# Altium schematic sheet Cellar Watchdog.SchDoc: Cellar Watchdog - Main
size A4; Date: Dec. 27th 2022; Author: Karl Asseily; DrawnBy: Karl Asseily; DocumentNumber: 202301111111; Revision: 1.2; SheetNumber: 1; SheetTotal: 20
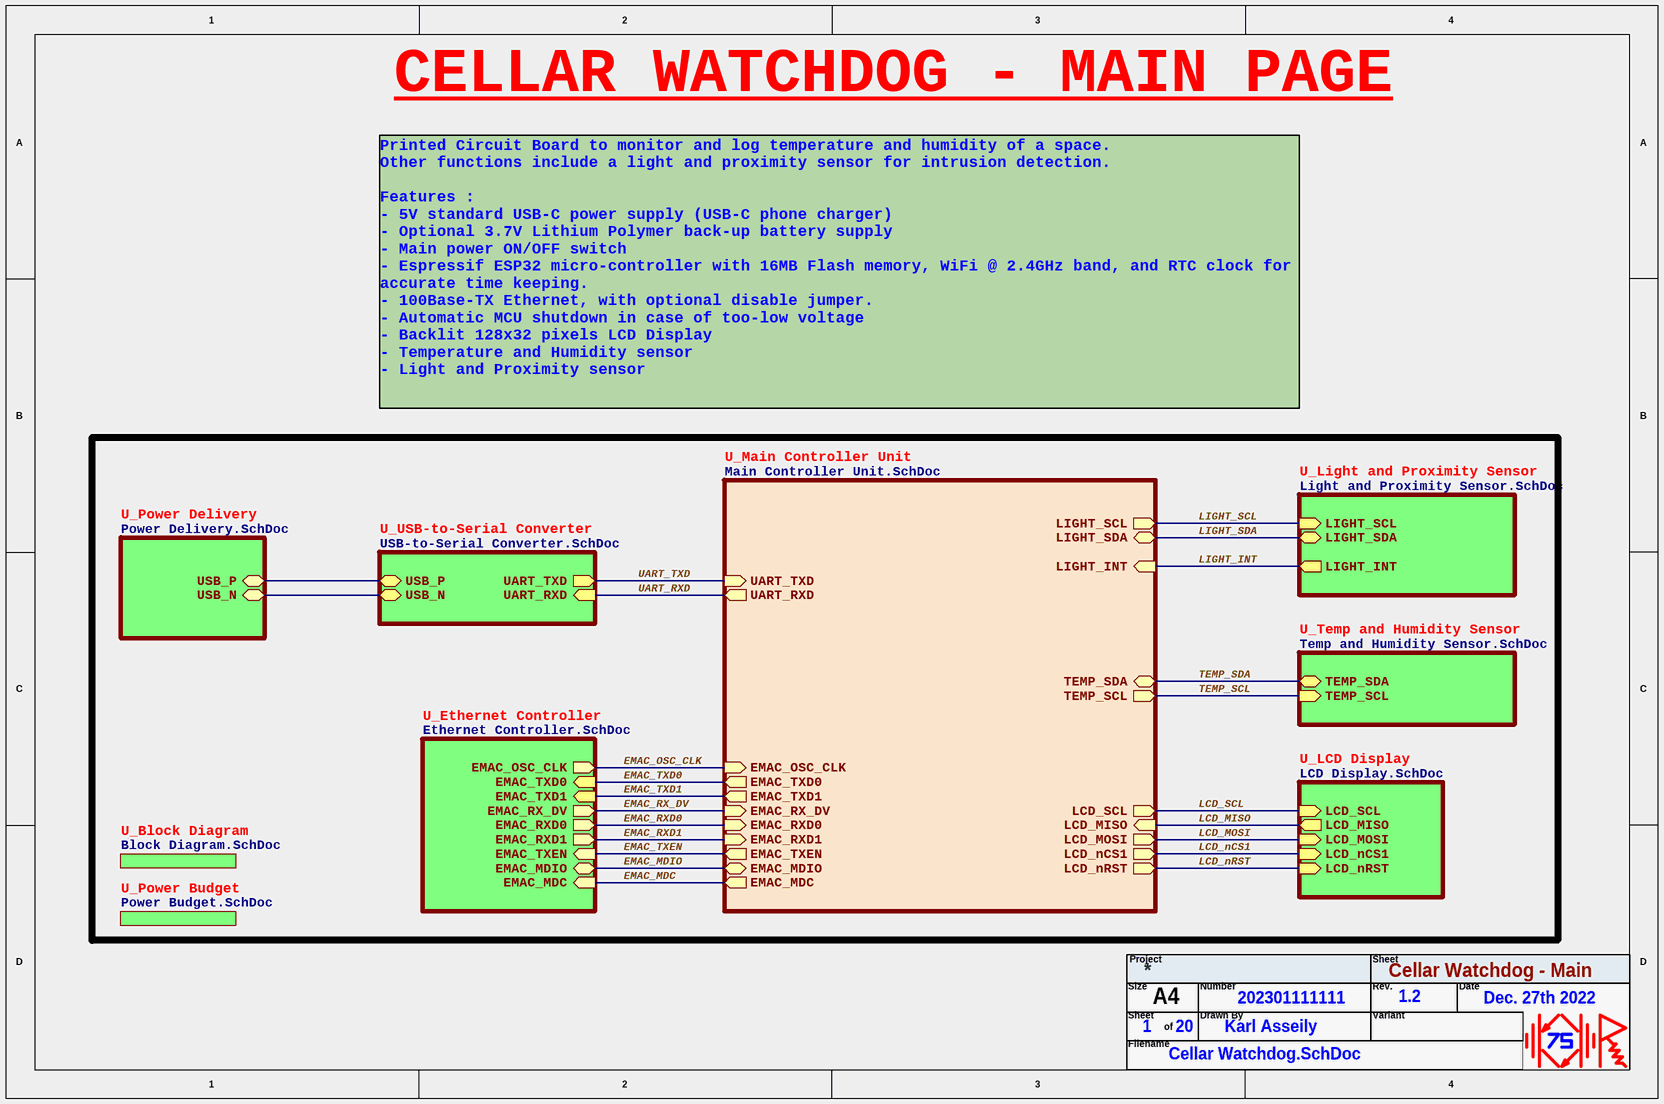
[diagram p0: Cellar Watchdog.SchDoc]

## Sub-sheets
U_Block Diagram = Block Diagram.SchDoc: no entries
U_Ethernet Controller = Ethernet Controller.SchDoc: EMAC_TXD0 (in), EMAC_TXD1 (in), EMAC_OSC_CLK (out), EMAC_RX_DV (out), EMAC_RXD0 (out), EMAC_RXD1 (out), EMAC_TXEN (in), EMAC_MDIO (bidir), EMAC_MDC (in)
U_LCD Display = LCD Display.SchDoc: LCD_nCS1 (in), LCD_nRST (in), LCD_MISO (out), LCD_SCL (in), LCD_MOSI (in)
U_Light and Proximity Sensor = Light and Proximity Sensor.SchDoc: LIGHT_SCL (in), LIGHT_SDA (bidir), LIGHT_INT (out)
U_Main Controller Unit = Main Controller Unit.SchDoc: UART_TXD (in), UART_RXD (out), LCD_SCL (out), LCD_MOSI (out), LCD_MISO (in), LCD_nRST (out), LCD_nCS1 (out), LIGHT_SCL (out), LIGHT_SDA (bidir), LIGHT_INT (in), TEMP_SDA (bidir), TEMP_SCL (out), EMAC_OSC_CLK (in), EMAC_TXD0 (out), EMAC_TXD1 (out), EMAC_RX_DV (in), EMAC_RXD0 (in), EMAC_RXD1 (in), EMAC_TXEN (out), EMAC_MDIO (bidir), EMAC_MDC (out)
U_Power Budget = Power Budget.SchDoc: no entries
U_Power Delivery = Power Delivery.SchDoc: USB_N (bidir), USB_P (bidir)
U_Temp and Humidity Sensor = Temp and Humidity Sensor.SchDoc: TEMP_SDA (bidir), TEMP_SCL (in)
U_USB-to-Serial Converter = USB-to-Serial Converter.SchDoc: UART_TXD (out), UART_RXD (in), USB_N (bidir), USB_P (bidir)

## Nets
EMAC_MDC: sheet U_Main Controller Unit/EMAC_MDC, sheet U_Ethernet Controller/EMAC_MDC
EMAC_MDIO: sheet U_Main Controller Unit/EMAC_MDIO, sheet U_Ethernet Controller/EMAC_MDIO
EMAC_OSC_CLK: sheet U_Main Controller Unit/EMAC_OSC_CLK, sheet U_Ethernet Controller/EMAC_OSC_CLK
EMAC_RX_DV: sheet U_Main Controller Unit/EMAC_RX_DV, sheet U_Ethernet Controller/EMAC_RX_DV
EMAC_RXD0: sheet U_Main Controller Unit/EMAC_RXD0, sheet U_Ethernet Controller/EMAC_RXD0
EMAC_RXD1: sheet U_Main Controller Unit/EMAC_RXD1, sheet U_Ethernet Controller/EMAC_RXD1
EMAC_TXD0: sheet U_Main Controller Unit/EMAC_TXD0, sheet U_Ethernet Controller/EMAC_TXD0
EMAC_TXD1: sheet U_Main Controller Unit/EMAC_TXD1, sheet U_Ethernet Controller/EMAC_TXD1
EMAC_TXEN: sheet U_Main Controller Unit/EMAC_TXEN, sheet U_Ethernet Controller/EMAC_TXEN
LCD_MISO: sheet U_Main Controller Unit/LCD_MISO, sheet U_LCD Display/LCD_MISO
LCD_MOSI: sheet U_Main Controller Unit/LCD_MOSI, sheet U_LCD Display/LCD_MOSI
LCD_nCS1: sheet U_Main Controller Unit/LCD_nCS1, sheet U_LCD Display/LCD_nCS1
LCD_nRST: sheet U_Main Controller Unit/LCD_nRST, sheet U_LCD Display/LCD_nRST
LCD_SCL: sheet U_Main Controller Unit/LCD_SCL, sheet U_LCD Display/LCD_SCL
LIGHT_INT: sheet U_Main Controller Unit/LIGHT_INT, sheet U_Light and Proximity Sensor/LIGHT_INT
LIGHT_SCL: sheet U_Main Controller Unit/LIGHT_SCL, sheet U_Light and Proximity Sensor/LIGHT_SCL
LIGHT_SDA: sheet U_Main Controller Unit/LIGHT_SDA, sheet U_Light and Proximity Sensor/LIGHT_SDA
TEMP_SCL: sheet U_Main Controller Unit/TEMP_SCL, sheet U_Temp and Humidity Sensor/TEMP_SCL
TEMP_SDA: sheet U_Main Controller Unit/TEMP_SDA, sheet U_Temp and Humidity Sensor/TEMP_SDA
UART_RXD: sheet U_Main Controller Unit/UART_RXD, sheet U_USB-to-Serial Converter/UART_RXD
UART_TXD: sheet U_Main Controller Unit/UART_TXD, sheet U_USB-to-Serial Converter/UART_TXD
(unnamed): sheet U_USB-to-Serial Converter/USB_N, sheet U_Power Delivery/USB_N
(unnamed): sheet U_USB-to-Serial Converter/USB_P, sheet U_Power Delivery/USB_P

## Notes on the sheet
- CELLAR WATCHDOG - MAIN PAGE
- Printed Circuit Board to monitor and log temperature and humidity of a space.
  Other functions include a light and proximity sensor for intrusion detection.
  Features :
  - 5V standard USB-C power supply (USB-C phone charger)
  - Optional 3.7V Lithium Polymer back-up battery supply
  - Main power ON/OFF switch
  - Espressif ESP32 micro-controller with 16MB Flash memory, WiFi @ 2.4GHz band, and RTC clock for accurate time keeping.
  - 100Base-TX Ethernet, with optional disable jumper.
  - Automatic MCU shutdown in case of too-low voltage
  - Backlit 128x32 pixels LCD Display
  - Temperature and Humidity sensor
  - Light and Proximity sensor
- Project
- Sheet
- Size
- Filename
- A4
- of
- Number
- Drawn By
- Rev.
- Variant
- Date